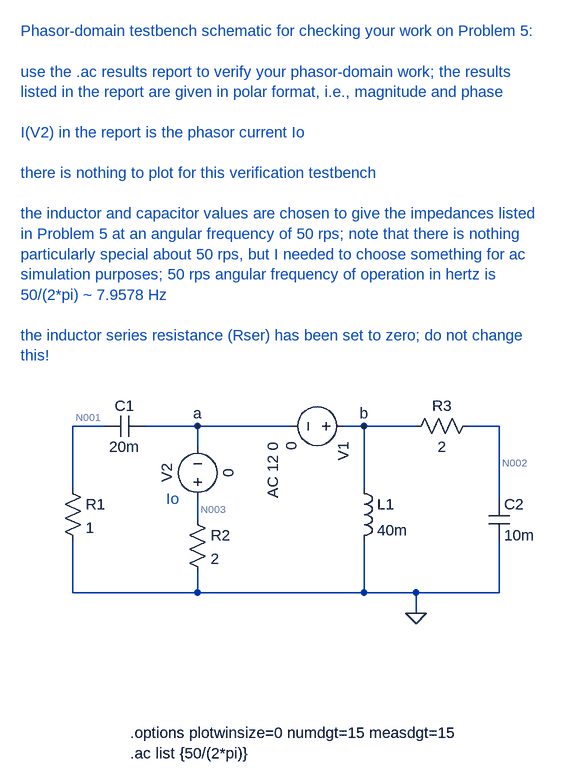
[diagram p0: schematic hw7_prob5.asc]
hw7_prob5.asc, the LTspice schematic file:
Version 4
SHEET 1 880 1112
WIRE -432 176 -480 176
WIRE -288 176 -368 176
WIRE -144 176 -288 176
WIRE -32 176 -64 176
WIRE 48 176 -32 176
WIRE 176 176 128 176
WIRE -288 208 -288 176
WIRE -480 272 -480 176
WIRE -32 272 -32 176
WIRE 176 288 176 176
WIRE -288 320 -288 288
WIRE -480 432 -480 352
WIRE -288 432 -288 400
WIRE -288 432 -480 432
WIRE -32 432 -32 352
WIRE -32 432 -288 432
WIRE 48 432 -32 432
WIRE 176 432 176 352
WIRE 176 432 48 432
WIRE 48 464 48 432
FLAG 48 464 0
FLAG -32 176 b
FLAG -288 176 a
SYMBOL voltage -48 176 R90
WINDOW 123 24 124 Left 2
SYMATTR Value2 AC 12 0
SYMATTR InstName V1
SYMATTR Value 0
SYMBOL res -496 256 R0
SYMATTR InstName R1
SYMATTR Value 1
SYMBOL voltage -288 304 R180
WINDOW 0 32 56 VTop 2
WINDOW 3 -32 56 VBottom 2
WINDOW 123 0 0 Left 0
WINDOW 39 0 0 Left 0
SYMATTR InstName V2
SYMATTR Value 0
SYMBOL ind -48 256 R0
SYMATTR InstName L1
SYMATTR Value 40m
SYMATTR SpiceLine Rser=0
SYMBOL cap -368 160 R90
WINDOW 0 0 32 VBottom 2
WINDOW 3 32 32 VTop 2
SYMATTR InstName C1
SYMATTR Value 20m
SYMBOL res -304 304 R0
SYMATTR InstName R2
SYMATTR Value 2
SYMBOL res 144 160 R90
WINDOW 0 0 56 VBottom 2
WINDOW 3 32 56 VTop 2
SYMATTR InstName R3
SYMATTR Value 2
SYMBOL cap 160 352 M180
WINDOW 0 24 56 Left 2
WINDOW 3 24 8 Left 2
SYMATTR InstName C2
SYMATTR Value 10m
TEXT -392 648 Left 2 !.options plotwinsize=0 numdgt=15 measdgt=15\n.ac list {50/(2*pi)}
TEXT -560 -432 Left 2 ;Phasor-domain testbench schematic for checking your work on Problem 5:\n \nuse the .ac results report to verify your phasor-domain work; the results\nlisted in the report are given in polar format, i.e., magnitude and phase\n \nI(V2) in the report is the phasor current Io\n \nthere is nothing to plot for this verification testbench\n \nthe inductor and capacitor values are chosen to give the impedances listed\nin Problem 5 at an angular frequency of 50 rps; note that there is nothing \nparticularly special about 50 rps, but I needed to choose something for ac \nsimulation purposes; 50 rps angular frequency of operation in hertz is\n50/(2*pi) ~ 7.9578 Hz\n \nthe inductor series resistance (Rser) has been set to zero; do not change \nthis!
TEXT -336 288 Left 2 ;Io

The netlist it stands for:
* hw7_prob5.asc
V1 b a 0 AC 12 0
R1 N001 0 1
V2 N003 a 0
L1 b 0 40m Rser=0
C1 a N001 20m
R2 N003 0 2
R3 N002 b 2
C2 0 N002 10m
.options plotwinsize=0 numdgt=15 measdgt=15
.ac list {50/(2*pi)}
* Phasor-domain testbench schematic for checking your work on Problem 5:
* use the .ac results report to verify your phasor-domain work; the results
* listed in the report are given in polar format, i.e., magnitude and phase
* I(V2) in the report is the phasor current Io
* there is nothing to plot for this verification testbench
* the inductor and capacitor values are chosen to give the impedances listed
* in Problem 5 at an angular frequency of 50 rps; note that there is nothing
* particularly special about 50 rps, but I needed to choose something for ac
* simulation purposes; 50 rps angular frequency of operation in hertz is
* 50/(2*pi) ~ 7.9578 Hz
* the inductor series resistance (Rser) has been set to zero; do not change
* this!
* Io
.backanno
.end

* Results of the author's LTspice run, read from the files saved beside the schematic
* AC Analysis:
*   frequency = 7.958 
*   V(b) = 10.15 V
*   V(a) = -1.846 V
*   V(n001) = -2.308 V
*   V(n003) = -1.846 V
*   V(n002) = 6.462 V
*   I(C1) = -2.308 A
*   I(C2) = -1.846 A
*   I(L1) = 1.385 A
*   I(R1) = -2.308 A
*   I(R2) = -923.1 mA
*   I(R3) = -1.846 A
*   I(V1) = -3.231 A
*   I(V2) = 923.1 mA